# EAGLE design schematic (EAGLE 9.6.2)
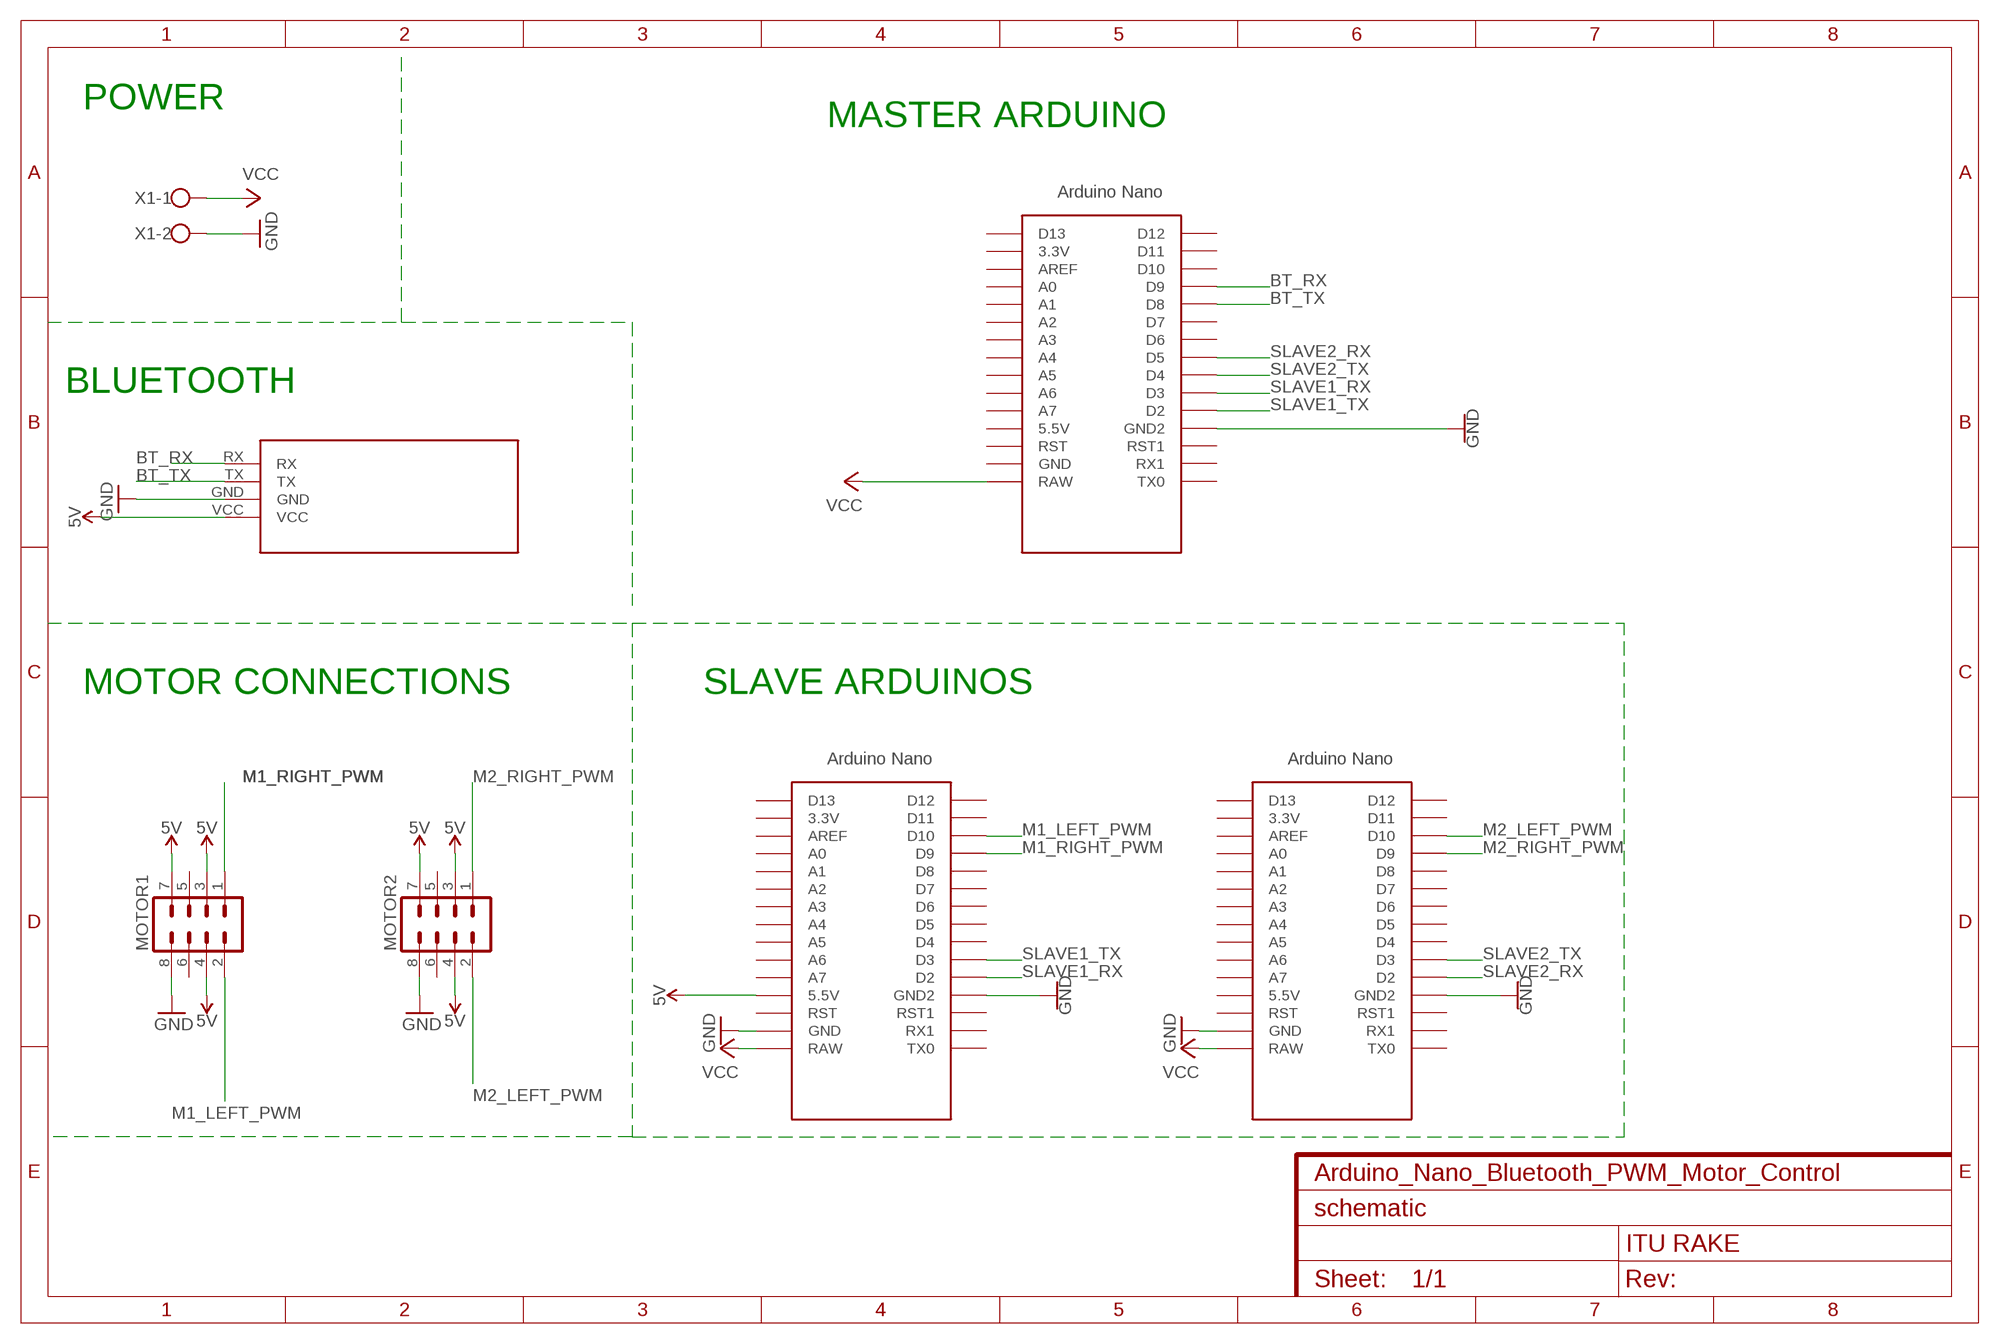
[diagram p0: schematic, sheet 1]
FRAME1 (FRAME-A4L): CNAME: Arduino_Nano_Bluetooth_PWM_Motor_Control; DESIGNER: ITU RAKE

## Parts
BT  HC06_BLUETOOTH  [HC06_BT_FOOTPRıNT]
MOTOR1  MA04-2  [MA04-2]
MOTOR2  MA04-2  [MA04-2]
U$1  NANO  [NANO]
U$2  NANO  [NANO]
U$3  NANO  [NANO]
X1  W237-102  [W237-102]

## Nets
5V: BT.VCC MOTOR1.3 MOTOR1.4 MOTOR1.7 MOTOR2.3 MOTOR2.4 MOTOR2.7 U$2.5V(5.5V)
BT_RX: BT.RX U$1.D9
BT_TX: BT.TX U$1.D8
GND: BT.GND MOTOR1.8 MOTOR2.8 U$1.GND1(GND2) U$2.GND U$2.GND1(GND2) U$3.GND U$3.GND1(GND2) X1.2
M1_LEFT_PWM: MOTOR1.2 U$2.D10
M1_RIGHT_PWM: MOTOR1.1 U$2.D9
M2_LEFT_PWM: MOTOR2.2 U$3.D10
M2_RIGHT_PWM: MOTOR2.1 U$3.D9
SLAVE1_RX: U$1.D3 U$2.D2
SLAVE1_TX: U$1.D2 U$2.D3
SLAVE2_RX: U$1.D5 U$3.D2
SLAVE2_TX: U$1.D4 U$3.D3
VCC: U$1.RAW U$2.RAW U$3.RAW X1.1
Unconnected: MOTOR1.5 MOTOR1.6 MOTOR2.5 MOTOR2.6 U$1.3.3V U$1.5V(5.5V) U$1.A0 U$1.A1 U$1.A2 U$1.A3 U$1.A4 U$1.A5 U$1.A6 U$1.A7 U$1.AREF U$1.D6 U$1.D7 U$1.D10 U$1.D11 U$1.D12 U$1.D13 U$1.GND U$1.ICSP1 U$1.ICSP2 U$1.ICSP3 U$1.ICSP4 U$1.ICSP5 U$1.ICSP6 U$1.RST U$1.RST1 U$1.RX1 U$1.TX0 U$2.3.3V U$2.A0 U$2.A1 U$2.A2 U$2.A3 U$2.A4 U$2.A5 U$2.A6 U$2.A7 U$2.AREF U$2.D4 U$2.D5 U$2.D6 U$2.D7 U$2.D8 U$2.D11 U$2.D12 U$2.D13 U$2.ICSP1 U$2.ICSP2 U$2.ICSP3 U$2.ICSP4 U$2.ICSP5 U$2.ICSP6 U$2.RST U$2.RST1 U$2.RX1 U$2.TX0 U$3.3.3V U$3.5V(5.5V) U$3.A0 U$3.A1 U$3.A2 U$3.A3 U$3.A4 U$3.A5 U$3.A6 U$3.A7 U$3.AREF U$3.D4 U$3.D5 U$3.D6 U$3.D7 U$3.D8 U$3.D11 U$3.D12 U$3.D13 U$3.ICSP1 U$3.ICSP2 U$3.ICSP3 U$3.ICSP4 U$3.ICSP5 U$3.ICSP6 U$3.RST U$3.RST1 U$3.RX1 U$3.TX0

## Notes on the sheet
- POWER
- MASTER ARDUINO
- BLUETOOTH
- MOTOR CONNECTIONS | SLAVE ARDUINOS

## Library data of the parts
BT = OnurLibrary:HC06_BLUETOOTH
MOTOR1 MOTOR2 = con-lstb:MA04-2: PIN HEADER; OC_FARNELL: unknown; OC_NEWARK: unknown
U$1-U$3 = Arduino-clone:NANO: Arduino Nano
X1 = con-wago-500:W237-102: WAGO SCREW CLAMP; MPN: 237-102; OC_FARNELL: unknown; OC_NEWARK: 70K9898

## Board
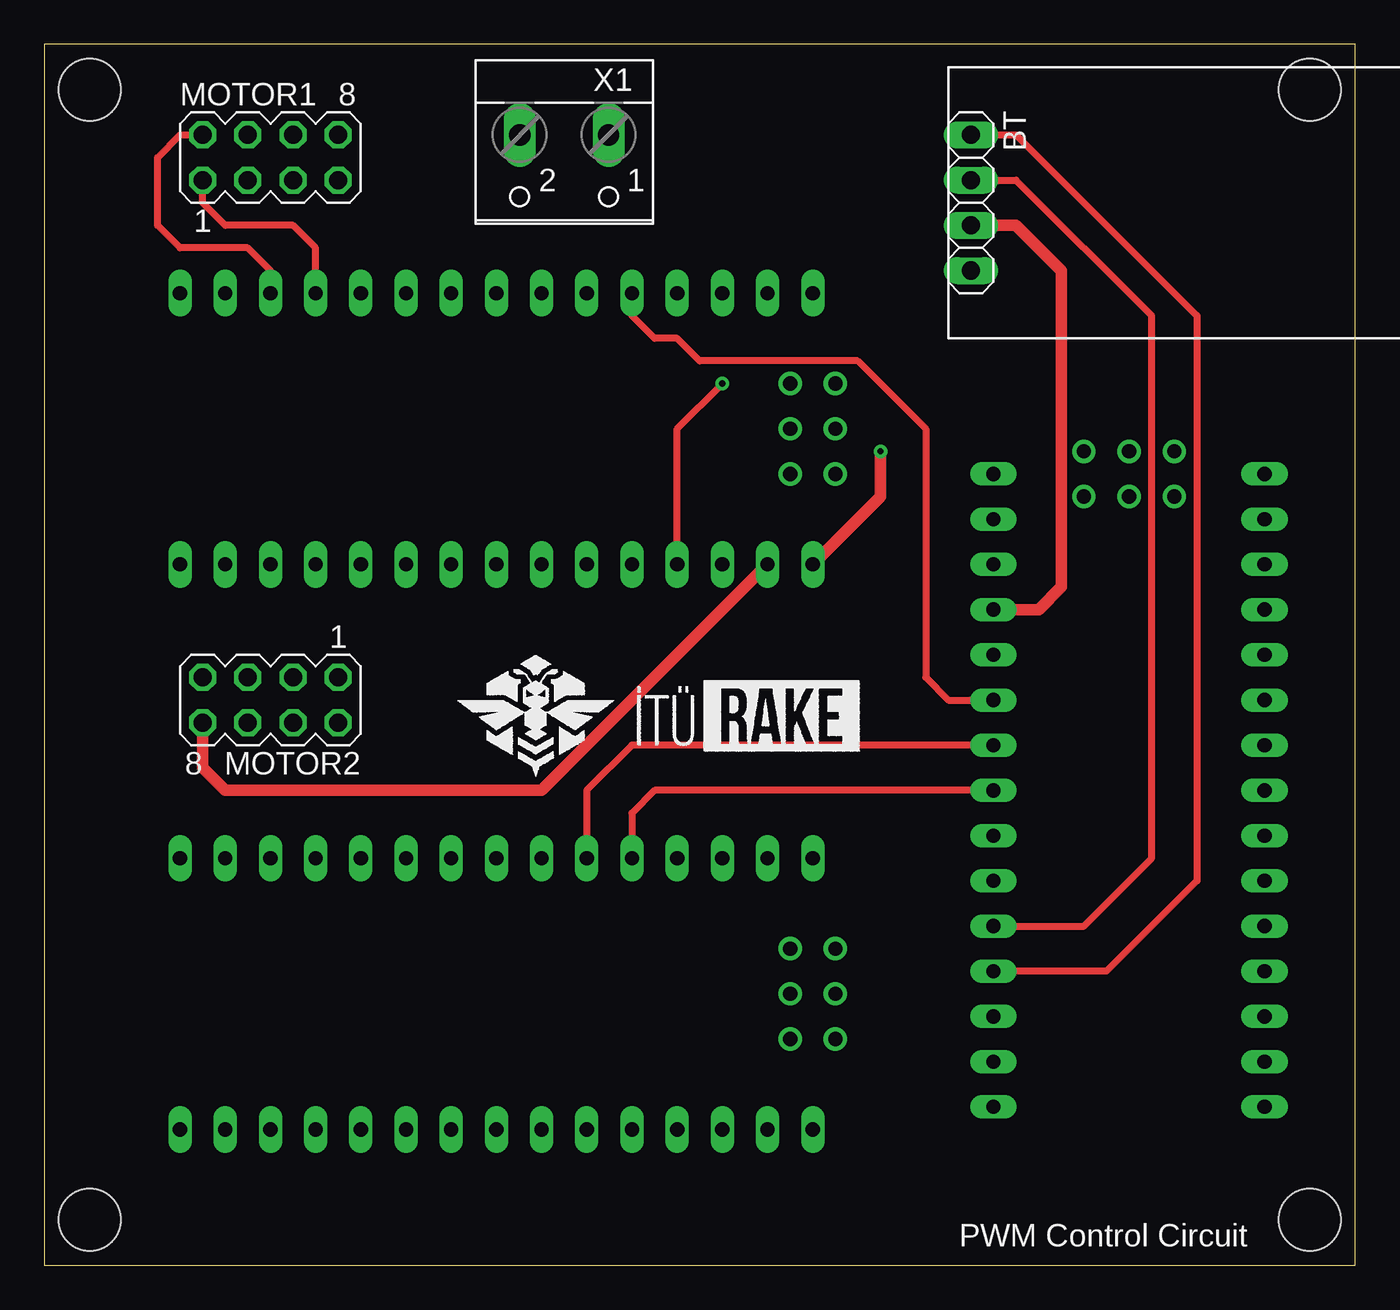
[diagram p1: board, top side]
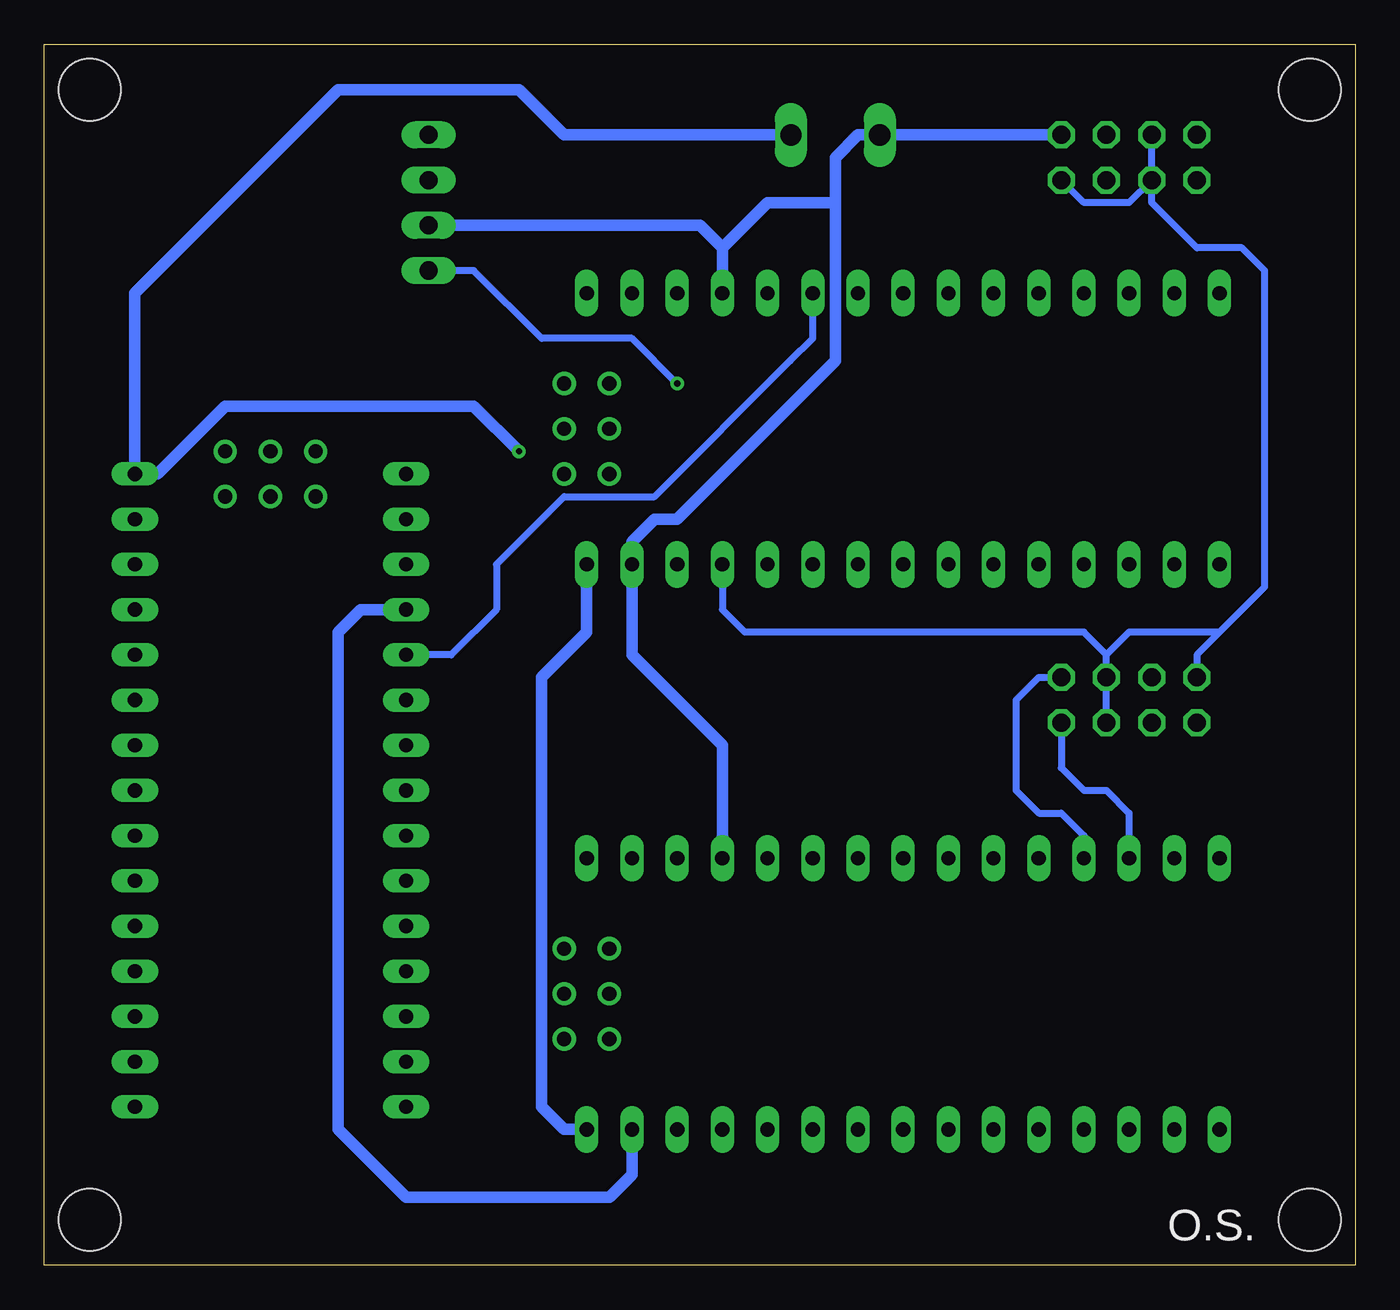
[diagram p2: board, bottom side, seen from below]

Size 73.66 x 68.58 mm. Coordinates in mm from the lower left corner, seen from the top.
Outline: 0,0 73.66,0 73.66,68.58 0,68.58 0,0
Copper layers (1*16): Top 0.035mm / dielectric 1.5mm / Bottom 0.035mm
Design rules "default": minimum track width 6mil, minimum drill 0.35mm, track to track 6mil, track to pad 6mil, pad to pad 6mil, via to via 6mil, smd to smd 6mil, copper to edge 40mil, drill to drill 6mil, minimum pad ring 10mil, minimum via ring 8mil, stop-mask expansion 4mil, vias tented up to drill 0mil, thermal gap 10mil
Holes 3.5 mm at 2.54,66.04 71.12,66.04 71.12,2.54 2.54,2.54

### Footprints (pad centres in the part's own frame; a part is rotated, then mirrored left to right if it is on the bottom)
HC06_BT_FOOTPRıNT = drill 1.016 long: GND 1.27,0; RX -3.81,0; TX -1.27,0; VCC 3.81,0
MA04-2 = drill 1.016 octagon: 1 -3.81,-1.27; 2 -3.81,1.27; 3 -1.27,-1.27; 4 -1.27,1.27; 5 1.27,-1.27; 6 1.27,1.27; 7 3.81,-1.27; 8 3.81,1.27
NANO = drill 0.8 long: 3.3V -10.16,24.13; 5V -10.16,-1.27; A0 -10.16,19.05; A1 -10.16,16.51; A2 -10.16,13.97; A3 -10.16,11.43; A4 -10.16,8.89; A5 -10.16,6.35; A6 -10.16,3.81; A7 -10.16,1.27; AREF -10.16,21.59; D2 5.08,1.27; D3 5.08,3.81; D4 5.08,6.35; D5 5.08,8.89; D6 5.08,11.43; D7 5.08,13.97; D8 5.08,16.51; D9 5.08,19.05; D10 5.08,21.59; D11 5.08,24.13; D12 5.08,26.67; D13 -10.16,26.67; GND -10.16,-6.35; GND1 5.08,-1.27; RAW -10.16,-8.89; RST -10.16,-3.81; RST1 5.08,-3.81; RX1 5.08,-6.35; TX0 5.08,-8.89 | drill 0.8: ICSP1 -5.08,-10.16; ICSP2 -5.08,-7.62; ICSP3 -2.54,-10.16; ICSP4 -2.54,-7.62; ICSP5 0,-10.16; ICSP6 0,-7.62
W237-102 = drill 1.194 long: 1 -2.5,-1.27; 2 2.5,-1.27

### Placement (x,y rotation side)
BT  52.07,59.69 270 top
MOTOR1  12.7,62.23 0 top
MOTOR2  12.7,31.75 180 top
U$1  58.42,35.56 180 top
U$2  34.29,49.53 90 top
U$3  34.29,17.78 90 top
X1  29.21,62.23 180 top

### Tracks (layer width: path | path; a pad name or v marks a point on that pad's centre or on a via)
5V  (via drill 0.35)
  Top 0.381: U$2.5V 35.56,46.99 v38.1,49.53
  Bottom 0.381: MOTOR2.4 MOTOR2.3 13.97,34.29 | 7.62,35.56 5.08,38.1 5.08,55.88 6.35,57.15 8.89,57.15 11.43,59.69 MOTOR1.3 | MOTOR1.3 MOTOR1.4 | MOTOR1.3 12.7,59.69 15.24,59.69 MOTOR1.7 | 7.62,35.56 8.89,34.29 MOTOR2.7 | v38.1,49.53 40.64,52.07 45.72,52.07 49.53,55.88 BT.VCC | U$2.5V 35.56,36.83 34.29,35.56 15.24,35.56 13.97,34.29 | 13.97,34.29 12.7,35.56 7.62,35.56
BT_RX
  Top 0.381: BT.RX 54.61,63.5 64.77,53.34 64.77,21.59 59.69,16.51 U$1.D9
BT_TX
  Top 0.381: BT.TX 54.61,60.96 62.23,53.34 62.23,22.86 58.42,19.05 U$1.D8
GND
  Top 0.635: U$2.GND 27.94,26.67 10.16,26.67 8.89,27.94 MOTOR2.8 | U$1.GND1 55.88,36.83 57.15,38.1 57.15,55.88 54.61,58.42 BT.GND
  Bottom 0.635: U$3.GND1 35.56,29.21 40.64,34.29 U$2.GND 40.64,40.64 39.37,41.91 38.1,41.91 29.21,50.8 29.21,59.69 | MOTOR1.8 X1.2 27.94,63.5 29.21,62.23 29.21,59.69 | U$3.GND 40.64,5.08 41.91,3.81 53.34,3.81 57.15,7.62 57.15,35.56 55.88,36.83 U$1.GND1 | 35.56,57.15 36.83,58.42 BT.GND | 35.56,57.15 U$2.GND1 | 35.56,57.15 33.02,59.69 29.21,59.69
M1_LEFT_PWM
  Top 0.381: MOTOR1.2 7.62,63.5 6.35,62.23 6.35,58.42 7.62,57.15 11.43,57.15 12.7,55.88 U$2.D10
M1_RIGHT_PWM
  Top 0.381: U$2.D9 15.24,57.15 13.97,58.42 10.16,58.42 8.89,59.69 MOTOR1.1
M2_LEFT_PWM
  Bottom 0.381: MOTOR2.2 16.51,27.94 15.24,26.67 13.97,26.67 12.7,25.4 U$3.D10
M2_RIGHT_PWM
  Bottom 0.381: MOTOR2.1 17.78,33.02 19.05,31.75 19.05,26.67 17.78,25.4 16.51,25.4 15.24,24.13 U$3.D9
SLAVE1_RX
  Top 0.381: U$2.D2 33.02,53.34 34.29,52.07 35.56,52.07 36.83,50.8 45.72,50.8 49.53,46.99 49.53,33.02 50.8,31.75 U$1.D3
SLAVE1_TX
  Bottom 0.381: U$2.D3 30.48,52.07 31.75,50.8 39.37,43.18 44.45,43.18 45.72,41.91 48.26,39.37 48.26,36.83 50.8,34.29 U$1.D2
SLAVE2_RX
  Top 0.381: U$3.D2 33.02,25.4 34.29,26.67 U$1.D5
SLAVE2_TX
  Top 0.381: U$3.D3 30.48,26.67 33.02,29.21 U$1.D4
VCC  (via drill 0.35)
  Top 0.635: U$2.RAW 46.99,43.18 v46.99,45.72
  Bottom 0.635: v46.99,45.72 49.53,48.26 63.5,48.26 67.31,44.45 U$1.RAW 68.58,54.61 57.15,66.04 46.99,66.04 44.45,63.5 X1.1 | U$2.RAW 43.18,35.56 45.72,33.02 45.72,8.89 44.45,7.62 U$3.RAW

### Text on the board
tPlace: PWM Control Circuit
bPlace: O.S.